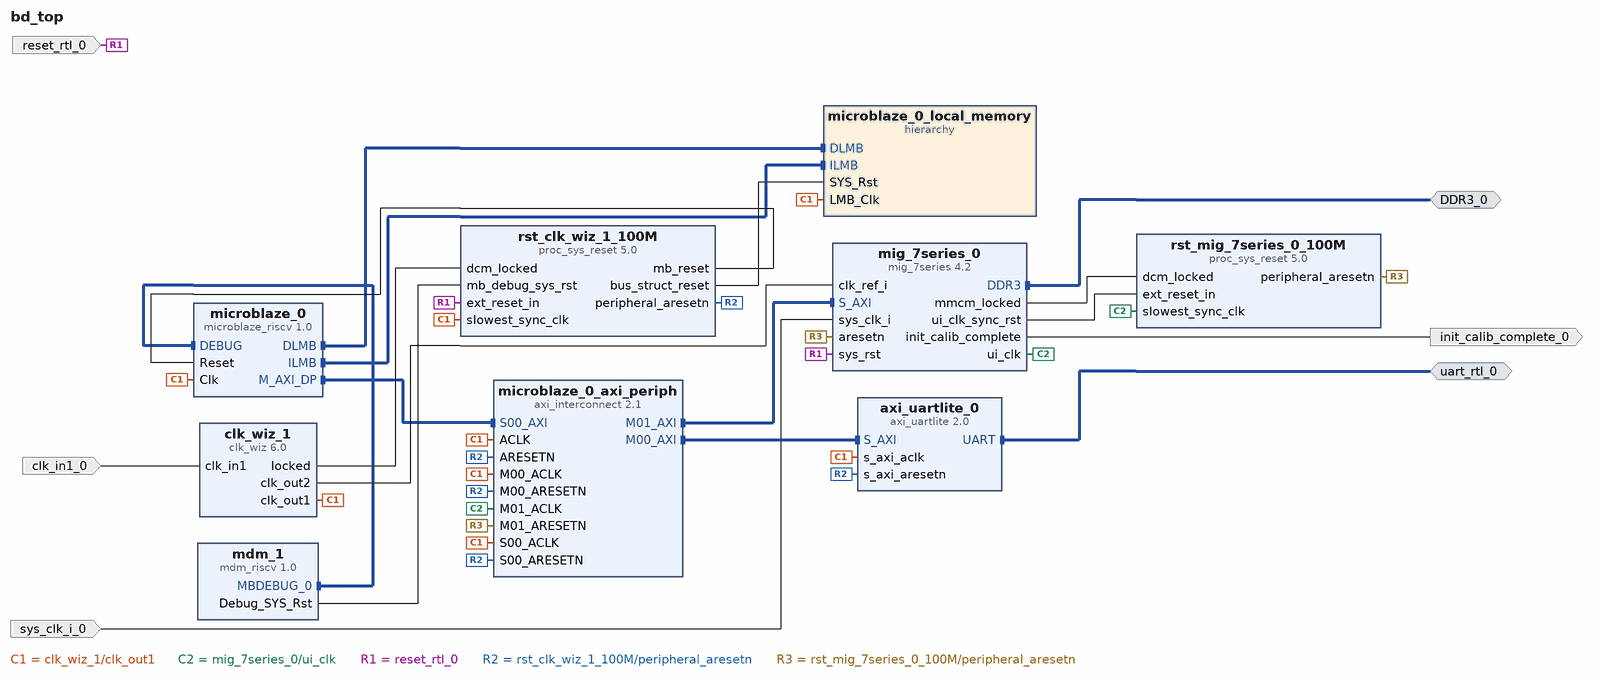
[diagram p0: block diagram of the top level]
# Vivado block design bd_top, xc7a100tfgg484-2, Vivado 2024.1
create_bd_design bd_top

create_bd_intf_port -mode Master -vlnv xilinx.com:interface:uart_rtl:1.0 uart_rtl_0
create_bd_intf_port -mode Master -vlnv xilinx.com:interface:ddrx_rtl:1.0 DDR3_0
create_bd_port -dir I -type rst reset_rtl_0
set_property -dict {CONFIG.POLARITY ACTIVE_LOW} [get_bd_ports reset_rtl_0]
create_bd_port -dir I -type clk clk_in1_0
create_bd_port -dir O init_calib_complete_0
create_bd_port -dir I -type clk sys_clk_i_0
set_property -dict {CONFIG.PHASE 0.0} [get_bd_ports sys_clk_i_0]

create_bd_cell -type hier microblaze_0_local_memory
create_bd_cell -type ip -vlnv xilinx.com:ip:clk_wiz:6.0 clk_wiz_1
set_property -dict [list \
  CONFIG.CLKOUT2_JITTER 114.829 \
  CONFIG.CLKOUT2_PHASE_ERROR 98.575 \
  CONFIG.CLKOUT2_REQUESTED_OUT_FREQ 200.000 \
  CONFIG.CLKOUT2_USED true \
  CONFIG.MMCM_CLKOUT1_DIVIDE 5 \
  CONFIG.NUM_OUT_CLKS 2 \
  CONFIG.PRIM_SOURCE Single_ended_clock_capable_pin \
  CONFIG.USE_RESET false \
] [get_bd_cells clk_wiz_1]
create_bd_cell -type ip -vlnv xilinx.com:ip:proc_sys_reset:5.0 rst_clk_wiz_1_100M
create_bd_cell -type ip -vlnv xilinx.com:ip:axi_uartlite:2.0 axi_uartlite_0
set_property -dict {CONFIG.C_BAUDRATE 115200} [get_bd_cells axi_uartlite_0]
create_bd_cell -type ip -vlnv xilinx.com:ip:axi_interconnect:2.1 microblaze_0_axi_periph
set_property -dict {CONFIG.NUM_MI 2} [get_bd_cells microblaze_0_axi_periph]
create_bd_cell -type ip -vlnv xilinx.com:ip:mig_7series:4.2 mig_7series_0
set_property -dict [list \
  CONFIG.BOARD_MIG_PARAM Custom \
  CONFIG.MIG_DONT_TOUCH_PARAM Custom \
  CONFIG.RESET_BOARD_INTERFACE Custom \
  CONFIG.XML_INPUT_FILE mig_b.prj \
] [get_bd_cells mig_7series_0]
create_bd_cell -type ip -vlnv xilinx.com:ip:proc_sys_reset:5.0 rst_mig_7series_0_100M
create_bd_cell -type ip -vlnv xilinx.com:ip:mdm_riscv:1.0 mdm_1
set_property -dict [list \
  CONFIG.C_ADDR_SIZE 32 \
  CONFIG.C_AVOID_PRIMITIVES 0 \
  CONFIG.C_BRK 0 \
  CONFIG.C_BSCANID 76547328 \
  CONFIG.C_DATA_SIZE 32 \
  CONFIG.C_DBG_MEM_ACCESS 0 \
  CONFIG.C_DBG_REG_ACCESS 0 \
  CONFIG.C_DEBUG_INTERFACE 0 \
  CONFIG.C_INTERCONNECT 2 \
  CONFIG.C_JTAG_CHAIN 2 \
  CONFIG.C_LMB_PROTOCOL 0 \
  CONFIG.C_MB_DBG_PORTS 1 \
  CONFIG.C_M_AXIS_DATA_WIDTH 32 \
  CONFIG.C_M_AXIS_ID_WIDTH 7 \
  CONFIG.C_M_AXI_ADDR_WIDTH 32 \
  CONFIG.C_M_AXI_DATA_WIDTH 32 \
  CONFIG.C_M_AXI_THREAD_ID_WIDTH 1 \
  CONFIG.C_S_AXI_ACLK_FREQ_HZ 100000000 \
  CONFIG.C_S_AXI_ADDR_WIDTH 9 \
  CONFIG.C_S_AXI_DATA_WIDTH 32 \
  CONFIG.C_USE_BSCAN 0 \
  CONFIG.C_USE_CONFIG_RESET 0 \
  CONFIG.C_XMTC 0 \
] [get_bd_cells mdm_1]
create_bd_cell -type ip -vlnv xilinx.com:ip:microblaze_riscv:1.0 microblaze_0
set_property -dict [list \
  CONFIG.C_ADDR_SIZE 32 \
  CONFIG.C_ASYNC_INTERRUPT 1 \
  CONFIG.C_ASYNC_WAKEUP 3 \
  CONFIG.C_AVOID_PRIMITIVES 0 \
  CONFIG.C_BASE_VECTORS 0x0000000000000000 \
  CONFIG.C_BRANCH_TARGET_CACHE_SIZE 0 \
  CONFIG.C_DATA_SIZE 32 \
  CONFIG.C_DC_AXI_MON 0 \
  CONFIG.C_DEBUG_COUNTER_WIDTH 32 \
  CONFIG.C_DEBUG_ENABLED 1 \
  CONFIG.C_DEBUG_EVENT_COUNTERS 5 \
  CONFIG.C_DEBUG_INTERFACE 0 \
  CONFIG.C_DEBUG_LATENCY_COUNTERS 1 \
  CONFIG.C_DEBUG_TRACE_ASYNC_RESET 0 \
  CONFIG.C_DP_AXI_MON 0 \
  CONFIG.C_D_AXI 1 \
  CONFIG.C_D_LMB 1 \
  CONFIG.C_D_LMB_MON 0 \
  CONFIG.C_D_LMB_PROTOCOL 0 \
  CONFIG.C_ECC_USE_CE_EXCEPTION 0 \
  CONFIG.C_EDGE_IS_POSITIVE 1 \
  CONFIG.C_ENABLE_DISCRETE_PORTS 0 \
  CONFIG.C_FAULT_TOLERANT 0 \
  CONFIG.C_FREQ 100000000 \
  CONFIG.C_FSL_LINKS 0 \
  CONFIG.C_IC_AXI_MON 0 \
  CONFIG.C_ILL_INSTR_EXCEPTION 0 \
  CONFIG.C_IMPRECISE_EXCEPTIONS 0 \
  CONFIG.C_INSTANCE microblaze \
  CONFIG.C_INTERCONNECT 2 \
  CONFIG.C_INTERRUPT_IS_EDGE 0 \
  CONFIG.C_INTERRUPT_MON 0 \
  CONFIG.C_IP_AXI_MON 0 \
  CONFIG.C_I_AXI 0 \
  CONFIG.C_I_LMB 1 \
  CONFIG.C_I_LMB_MON 0 \
  CONFIG.C_I_LMB_PROTOCOL 0 \
  CONFIG.C_LMB_DATA_SIZE 32 \
  CONFIG.C_LOCKSTEP_SELECT 0 \
  CONFIG.C_LOCKSTEP_SLAVE 0 \
  CONFIG.C_M0_AXIS_DATA_WIDTH 32 \
  CONFIG.C_M0_AXIS_PROTOCOL GENERIC \
  CONFIG.C_M10_AXIS_DATA_WIDTH 32 \
  CONFIG.C_M10_AXIS_PROTOCOL GENERIC \
  CONFIG.C_M11_AXIS_DATA_WIDTH 32 \
  CONFIG.C_M11_AXIS_PROTOCOL GENERIC \
  CONFIG.C_M12_AXIS_DATA_WIDTH 32 \
  CONFIG.C_M12_AXIS_PROTOCOL GENERIC \
  CONFIG.C_M13_AXIS_DATA_WIDTH 32 \
  CONFIG.C_M13_AXIS_PROTOCOL GENERIC \
  CONFIG.C_M14_AXIS_DATA_WIDTH 32 \
  CONFIG.C_M14_AXIS_PROTOCOL GENERIC \
  CONFIG.C_M15_AXIS_DATA_WIDTH 32 \
  CONFIG.C_M15_AXIS_PROTOCOL GENERIC \
  CONFIG.C_M1_AXIS_DATA_WIDTH 32 \
  CONFIG.C_M1_AXIS_PROTOCOL GENERIC \
  CONFIG.C_M2_AXIS_DATA_WIDTH 32 \
  CONFIG.C_M2_AXIS_PROTOCOL GENERIC \
  CONFIG.C_M3_AXIS_DATA_WIDTH 32 \
  CONFIG.C_M3_AXIS_PROTOCOL GENERIC \
  CONFIG.C_M4_AXIS_DATA_WIDTH 32 \
  CONFIG.C_M4_AXIS_PROTOCOL GENERIC \
  CONFIG.C_M5_AXIS_DATA_WIDTH 32 \
  CONFIG.C_M5_AXIS_PROTOCOL GENERIC \
  CONFIG.C_M6_AXIS_DATA_WIDTH 32 \
  CONFIG.C_M6_AXIS_PROTOCOL GENERIC \
  CONFIG.C_M7_AXIS_DATA_WIDTH 32 \
  CONFIG.C_M7_AXIS_PROTOCOL GENERIC \
  CONFIG.C_M8_AXIS_DATA_WIDTH 32 \
  CONFIG.C_M8_AXIS_PROTOCOL GENERIC \
  CONFIG.C_M9_AXIS_DATA_WIDTH 32 \
  CONFIG.C_M9_AXIS_PROTOCOL GENERIC \
  CONFIG.C_MISALIGNED_EXCEPTIONS 0 \
  CONFIG.C_MMU_PRIVILEGED_INSTR 0 \
  CONFIG.C_M_AXI_DC_ADDR_WIDTH 32 \
  CONFIG.C_M_AXI_DC_ARUSER_WIDTH 5 \
  CONFIG.C_M_AXI_DC_AWUSER_WIDTH 5 \
  CONFIG.C_M_AXI_DC_BUSER_WIDTH 1 \
  CONFIG.C_M_AXI_DC_EXCLUSIVE_ACCESS 0 \
  CONFIG.C_M_AXI_DC_RUSER_WIDTH 1 \
  CONFIG.C_M_AXI_DC_THREAD_ID_WIDTH 1 \
  CONFIG.C_M_AXI_DC_USER_SIGNALS 0 \
  CONFIG.C_M_AXI_DC_USER_VALUE 31 \
  CONFIG.C_M_AXI_DC_WUSER_WIDTH 1 \
  CONFIG.C_M_AXI_DP_ADDR_WIDTH 32 \
  CONFIG.C_M_AXI_DP_DATA_WIDTH 32 \
  CONFIG.C_M_AXI_DP_EXCLUSIVE_ACCESS 0 \
  CONFIG.C_M_AXI_DP_THREAD_ID_WIDTH 1 \
  CONFIG.C_M_AXI_D_BUS_EXCEPTION 0 \
  CONFIG.C_M_AXI_IC_ADDR_WIDTH 32 \
  CONFIG.C_M_AXI_IC_ARUSER_WIDTH 5 \
  CONFIG.C_M_AXI_IC_AWUSER_WIDTH 5 \
  CONFIG.C_M_AXI_IC_BUSER_WIDTH 1 \
  CONFIG.C_M_AXI_IC_RUSER_WIDTH 1 \
  CONFIG.C_M_AXI_IC_THREAD_ID_WIDTH 1 \
  CONFIG.C_M_AXI_IC_USER_SIGNALS 0 \
  CONFIG.C_M_AXI_IC_USER_VALUE 31 \
  CONFIG.C_M_AXI_IC_WUSER_WIDTH 1 \
  CONFIG.C_M_AXI_IP_ADDR_WIDTH 32 \
  CONFIG.C_M_AXI_IP_DATA_WIDTH 32 \
  CONFIG.C_M_AXI_IP_THREAD_ID_WIDTH 1 \
  CONFIG.C_NUMBER_OF_PC_BRK 1 \
  CONFIG.C_NUMBER_OF_RD_ADDR_BRK 0 \
  CONFIG.C_NUMBER_OF_WR_ADDR_BRK 0 \
  CONFIG.C_NUM_SYNC_FF_CLK 2 \
  CONFIG.C_NUM_SYNC_FF_CLK_DEBUG 2 \
  CONFIG.C_NUM_SYNC_FF_CLK_IRQ 1 \
  CONFIG.C_NUM_SYNC_FF_DBG_CLK 1 \
  CONFIG.C_NUM_SYNC_FF_DBG_TRACE_CLK 2 \
  CONFIG.C_OPTIMIZATION 0 \
  CONFIG.C_PC_WIDTH 32 \
  CONFIG.C_S0_AXIS_DATA_WIDTH 32 \
  CONFIG.C_S0_AXIS_PROTOCOL GENERIC \
  CONFIG.C_S10_AXIS_DATA_WIDTH 32 \
  CONFIG.C_S10_AXIS_PROTOCOL GENERIC \
  CONFIG.C_S11_AXIS_DATA_WIDTH 32 \
  CONFIG.C_S11_AXIS_PROTOCOL GENERIC \
  CONFIG.C_S12_AXIS_DATA_WIDTH 32 \
  CONFIG.C_S12_AXIS_PROTOCOL GENERIC \
  CONFIG.C_S13_AXIS_DATA_WIDTH 32 \
  CONFIG.C_S13_AXIS_PROTOCOL GENERIC \
  CONFIG.C_S14_AXIS_DATA_WIDTH 32 \
  CONFIG.C_S14_AXIS_PROTOCOL GENERIC \
  CONFIG.C_S15_AXIS_DATA_WIDTH 32 \
  CONFIG.C_S15_AXIS_PROTOCOL GENERIC \
  CONFIG.C_S1_AXIS_DATA_WIDTH 32 \
  CONFIG.C_S1_AXIS_PROTOCOL GENERIC \
  CONFIG.C_S2_AXIS_DATA_WIDTH 32 \
  CONFIG.C_S2_AXIS_PROTOCOL GENERIC \
  CONFIG.C_S3_AXIS_DATA_WIDTH 32 \
  CONFIG.C_S3_AXIS_PROTOCOL GENERIC \
  CONFIG.C_S4_AXIS_DATA_WIDTH 32 \
  CONFIG.C_S4_AXIS_PROTOCOL GENERIC \
  CONFIG.C_S5_AXIS_DATA_WIDTH 32 \
  CONFIG.C_S5_AXIS_PROTOCOL GENERIC \
  CONFIG.C_S6_AXIS_DATA_WIDTH 32 \
  CONFIG.C_S6_AXIS_PROTOCOL GENERIC \
  CONFIG.C_S7_AXIS_DATA_WIDTH 32 \
  CONFIG.C_S7_AXIS_PROTOCOL GENERIC \
  CONFIG.C_S8_AXIS_DATA_WIDTH 32 \
  CONFIG.C_S8_AXIS_PROTOCOL GENERIC \
  CONFIG.C_S9_AXIS_DATA_WIDTH 32 \
  CONFIG.C_S9_AXIS_PROTOCOL GENERIC \
  CONFIG.C_TEMPORAL_DEPTH 0 \
  CONFIG.C_TRACE 0 \
  CONFIG.C_USE_ATOMIC 0 \
  CONFIG.C_USE_BARREL 2 \
  CONFIG.C_USE_BRANCH_TARGET_CACHE 0 \
  CONFIG.C_USE_COMPRESSION 1 \
  CONFIG.C_USE_CONFIG_RESET 0 \
  CONFIG.C_USE_DCACHE 0 \
  CONFIG.C_USE_EXT_BRK 0 \
  CONFIG.C_USE_EXT_NM_BRK 0 \
  CONFIG.C_USE_FPU 0 \
  CONFIG.C_USE_ICACHE 0 \
  CONFIG.C_USE_INTERRUPT 0 \
  CONFIG.C_USE_MMU 0 \
  CONFIG.C_USE_MULDIV 0 \
  CONFIG.C_USE_NON_SECURE 0 \
  CONFIG.G_TEMPLATE_LIST 0 \
] [get_bd_cells microblaze_0]

# ---- hierarchy /microblaze_0_local_memory ----
current_bd_instance /microblaze_0_local_memory
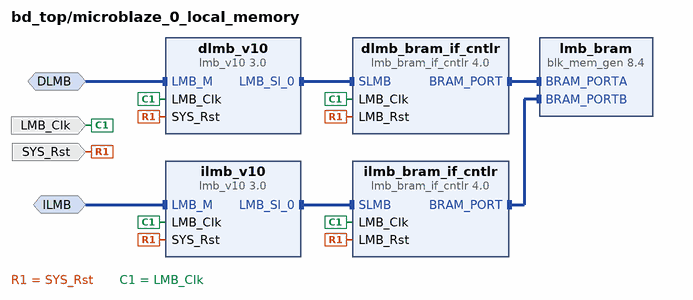
[diagram p1: block diagram inside /microblaze_0_local_memory]
create_bd_intf_pin -mode MirroredMaster -vlnv xilinx.com:interface:lmb_rtl:1.0 DLMB
create_bd_intf_pin -mode MirroredMaster -vlnv xilinx.com:interface:lmb_rtl:1.0 ILMB
create_bd_pin -dir I -type clk LMB_Clk
create_bd_pin -dir I -type rst SYS_Rst

create_bd_cell -type ip -vlnv xilinx.com:ip:lmb_v10:3.0 dlmb_v10
create_bd_cell -type ip -vlnv xilinx.com:ip:lmb_v10:3.0 ilmb_v10
create_bd_cell -type ip -vlnv xilinx.com:ip:lmb_bram_if_cntlr:4.0 dlmb_bram_if_cntlr
set_property -dict {CONFIG.C_ECC 0} [get_bd_cells dlmb_bram_if_cntlr]
create_bd_cell -type ip -vlnv xilinx.com:ip:lmb_bram_if_cntlr:4.0 ilmb_bram_if_cntlr
set_property -dict {CONFIG.C_ECC 0} [get_bd_cells ilmb_bram_if_cntlr]
create_bd_cell -type ip -vlnv xilinx.com:ip:blk_mem_gen:8.4 lmb_bram
set_property -dict [list \
  CONFIG.Enable_B Use_ENB_Pin \
  CONFIG.Memory_Type True_Dual_Port_RAM \
  CONFIG.Port_B_Clock 100 \
  CONFIG.Port_B_Enable_Rate 100 \
  CONFIG.Port_B_Write_Rate 50 \
  CONFIG.Use_RSTB_Pin true \
  CONFIG.use_bram_block BRAM_Controller \
] [get_bd_cells lmb_bram]

# ---- connections ----

current_bd_instance /microblaze_0_local_memory
connect_bd_intf_net -intf_net microblaze_0_dlmb [get_bd_intf_pins DLMB] [get_bd_intf_pins dlmb_v10/LMB_M]
connect_bd_intf_net -intf_net microblaze_0_dlmb_bus [get_bd_intf_pins dlmb_v10/LMB_Sl_0] [get_bd_intf_pins dlmb_bram_if_cntlr/SLMB]
connect_bd_intf_net -intf_net microblaze_0_dlmb_cntlr [get_bd_intf_pins dlmb_bram_if_cntlr/BRAM_PORT] [get_bd_intf_pins lmb_bram/BRAM_PORTA]
connect_bd_intf_net -intf_net microblaze_0_ilmb [get_bd_intf_pins ILMB] [get_bd_intf_pins ilmb_v10/LMB_M]
connect_bd_intf_net -intf_net microblaze_0_ilmb_bus [get_bd_intf_pins ilmb_v10/LMB_Sl_0] [get_bd_intf_pins ilmb_bram_if_cntlr/SLMB]
connect_bd_intf_net -intf_net microblaze_0_ilmb_cntlr [get_bd_intf_pins ilmb_bram_if_cntlr/BRAM_PORT] [get_bd_intf_pins lmb_bram/BRAM_PORTB]
connect_bd_net [get_bd_pins SYS_Rst] \
  [get_bd_pins dlmb_bram_if_cntlr/LMB_Rst] [get_bd_pins dlmb_v10/SYS_Rst] [get_bd_pins ilmb_bram_if_cntlr/LMB_Rst] \
  [get_bd_pins ilmb_v10/SYS_Rst]
connect_bd_net -net microblaze_0_Clk [get_bd_pins LMB_Clk] \
  [get_bd_pins dlmb_bram_if_cntlr/LMB_Clk] [get_bd_pins dlmb_v10/LMB_Clk] [get_bd_pins ilmb_bram_if_cntlr/LMB_Clk] \
  [get_bd_pins ilmb_v10/LMB_Clk]
set_property HDL_ATTRIBUTE.BMM_INFO_ADDRESS_SPACE {byte  0x00000000 32 > bd_top microblaze_0_local_memory/lmb_bram} [get_bd_cells dlmb_bram_if_cntlr]
set_property HDL_ATTRIBUTE.KEEP_HIERARCHY yes [get_bd_cells dlmb_bram_if_cntlr]

current_bd_instance /
connect_bd_intf_net [get_bd_intf_ports uart_rtl_0] [get_bd_intf_pins axi_uartlite_0/UART]
connect_bd_intf_net [get_bd_intf_pins microblaze_0/M_AXI_DP] [get_bd_intf_pins microblaze_0_axi_periph/S00_AXI]
connect_bd_intf_net [get_bd_intf_pins microblaze_0_axi_periph/M00_AXI] [get_bd_intf_pins axi_uartlite_0/S_AXI]
connect_bd_intf_net [get_bd_intf_pins microblaze_0_axi_periph/M01_AXI] [get_bd_intf_pins mig_7series_0/S_AXI]
connect_bd_intf_net [get_bd_intf_pins mdm_1/MBDEBUG_0] [get_bd_intf_pins microblaze_0/DEBUG]
connect_bd_intf_net [get_bd_intf_pins microblaze_0/DLMB] [get_bd_intf_pins microblaze_0_local_memory/DLMB]
connect_bd_intf_net [get_bd_intf_pins microblaze_0/ILMB] [get_bd_intf_pins microblaze_0_local_memory/ILMB]
connect_bd_intf_net [get_bd_intf_ports DDR3_0] [get_bd_intf_pins mig_7series_0/DDR3]
connect_bd_net -net clk_in1_0_1 [get_bd_ports clk_in1_0] [get_bd_pins clk_wiz_1/clk_in1]
connect_bd_net [get_bd_pins clk_wiz_1/clk_out2] [get_bd_pins mig_7series_0/clk_ref_i]
connect_bd_net [get_bd_pins clk_wiz_1/locked] [get_bd_pins rst_clk_wiz_1_100M/dcm_locked]
connect_bd_net [get_bd_pins mdm_1/Debug_SYS_Rst] [get_bd_pins rst_clk_wiz_1_100M/mb_debug_sys_rst]
connect_bd_net -net microblaze_0_Clk [get_bd_pins clk_wiz_1/clk_out1] \
  [get_bd_pins microblaze_0_local_memory/LMB_Clk] [get_bd_pins axi_uartlite_0/s_axi_aclk] \
  [get_bd_pins microblaze_0_axi_periph/ACLK] [get_bd_pins microblaze_0_axi_periph/S00_ACLK] \
  [get_bd_pins microblaze_0_axi_periph/M00_ACLK] [get_bd_pins rst_clk_wiz_1_100M/slowest_sync_clk] \
  [get_bd_pins microblaze_0/Clk]
connect_bd_net [get_bd_pins mig_7series_0/init_calib_complete] [get_bd_ports init_calib_complete_0]
connect_bd_net [get_bd_pins mig_7series_0/mmcm_locked] [get_bd_pins rst_mig_7series_0_100M/dcm_locked]
connect_bd_net [get_bd_pins mig_7series_0/ui_clk] [get_bd_pins microblaze_0_axi_periph/M01_ACLK] [get_bd_pins rst_mig_7series_0_100M/slowest_sync_clk]
connect_bd_net [get_bd_pins mig_7series_0/ui_clk_sync_rst] [get_bd_pins rst_mig_7series_0_100M/ext_reset_in]
connect_bd_net -net reset_rtl_0_1 [get_bd_ports reset_rtl_0] [get_bd_pins mig_7series_0/sys_rst] [get_bd_pins rst_clk_wiz_1_100M/ext_reset_in]
connect_bd_net [get_bd_pins rst_clk_wiz_1_100M/bus_struct_reset] [get_bd_pins microblaze_0_local_memory/SYS_Rst]
connect_bd_net [get_bd_pins rst_clk_wiz_1_100M/mb_reset] [get_bd_pins microblaze_0/Reset]
connect_bd_net [get_bd_pins rst_clk_wiz_1_100M/peripheral_aresetn] \
  [get_bd_pins axi_uartlite_0/s_axi_aresetn] [get_bd_pins microblaze_0_axi_periph/ARESETN] \
  [get_bd_pins microblaze_0_axi_periph/S00_ARESETN] [get_bd_pins microblaze_0_axi_periph/M00_ARESETN]
connect_bd_net [get_bd_pins rst_mig_7series_0_100M/peripheral_aresetn] \
  [get_bd_pins mig_7series_0/aresetn] [get_bd_pins microblaze_0_axi_periph/M01_ARESETN]
connect_bd_net -net sys_clk_i_0_1 [get_bd_ports sys_clk_i_0] [get_bd_pins mig_7series_0/sys_clk_i]
set_property HDL_ATTRIBUTE.BMM_INFO_PROCESSOR {riscv > bd_top microblaze_0_local_memory/dlmb_bram_if_cntlr} [get_bd_cells microblaze_0]
set_property HDL_ATTRIBUTE.KEEP_HIERARCHY yes [get_bd_cells microblaze_0]

# ---- address map ----
assign_bd_address -offset 0x00000000 -range 16K -target_address_space [get_bd_addr_spaces microblaze_0/Data] [get_bd_addr_segs microblaze_0_local_memory/dlmb_bram_if_cntlr/SLMB/Mem]
assign_bd_address -offset 0x40600000 -range 64K -target_address_space [get_bd_addr_spaces microblaze_0/Data] [get_bd_addr_segs axi_uartlite_0/S_AXI/Reg]
assign_bd_address -offset 0x80000000 -range 512M -target_address_space [get_bd_addr_spaces microblaze_0/Data] [get_bd_addr_segs mig_7series_0/memmap/memaddr]
assign_bd_address -offset 0x00000000 -range 16K -target_address_space [get_bd_addr_spaces microblaze_0/Instruction] [get_bd_addr_segs microblaze_0_local_memory/ilmb_bram_if_cntlr/SLMB/Mem]

validate_bd_design
save_bd_design
